# EAGLE design LEDboard (EAGLE 6.4)
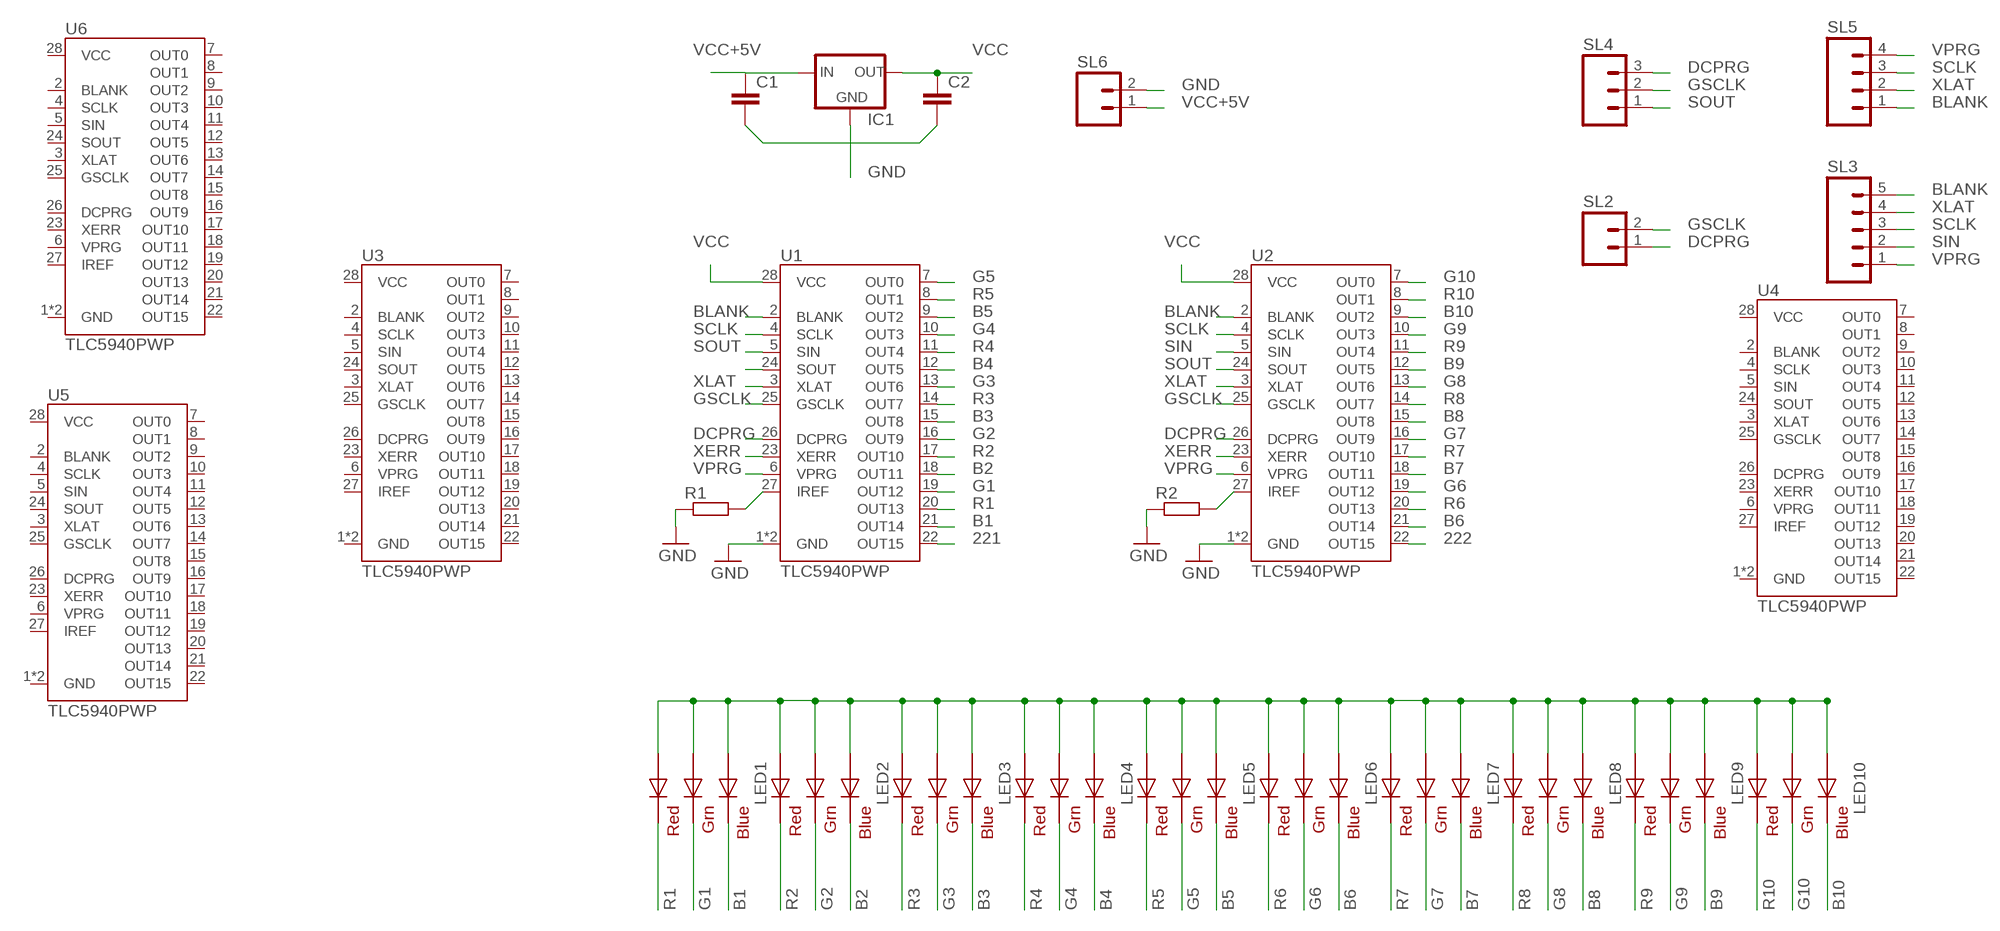
[diagram p0: schematic, sheet 1]

## Parts
C1  C-EU050-025X075  [C050-025X075]
C2  C-EU050-025X075  [C050-025X075]
IC1  78XXL  [78XXL]
LED1  RGBLED5050  [RGBLED5050]
LED2  RGBLED5050  [RGBLED5050]
LED3  RGBLED5050  [RGBLED5050]
LED4  RGBLED5050  [RGBLED5050]
LED5  RGBLED5050  [RGBLED5050]
LED6  RGBLED5050  [RGBLED5050]
LED7  RGBLED5050  [RGBLED5050]
LED8  RGBLED5050  [RGBLED5050]
LED9  RGBLED5050  [RGBLED5050]
LED10  RGBLED5050  [RGBLED5050]
R1  R-EU_M1406  [M1406]
R2  R-EU_M1406  [M1406]
SL2  M02  [02P]
SL3  M05  [05P]
SL4  M03  [03P]
SL5  M04  [04P]
SL6  M02  [02P]
U1  TLC5940PWP  [TSSOP28-GROUNDPAD]
U2  TLC5940PWP  [TSSOP28-GROUNDPAD]
U3  TLC5940PWP  [TSSOP28-GROUNDPAD]
U4  TLC5940PWP  [TSSOP28-GROUNDPAD]
U5  TLC5940PWP  [TSSOP28-GROUNDPAD]
U6  TLC5940PWP  [TSSOP28-GROUNDPAD]

## Nets
221: U1.22(OUT15)
222: U2.22(OUT15)
B1: LED1.4(BLUE_C) U1.21(OUT14)
B2: LED2.4(BLUE_C) U1.18(OUT11)
B3: LED3.4(BLUE_C) U1.15(OUT8)
B4: LED4.4(BLUE_C) U1.12(OUT5)
B5: LED5.4(BLUE_C) U1.9(OUT2)
B6: LED6.4(BLUE_C) U2.21(OUT14)
B7: LED7.4(BLUE_C) U2.18(OUT11)
B8: LED8.4(BLUE_C) U2.15(OUT8)
B9: LED9.4(BLUE_C) U2.12(OUT5)
B10: LED10.4(BLUE_C) U2.9(OUT2)
BLANK: SL3.5 SL5.1 U1.2(BLANK) U2.2(BLANK)
DCPRG: SL2.1 SL4.3 U1.26(DCPRG) U2.26(DCPRG)
G1: LED1.6(GREEN_C) U1.19(OUT12)
G2: LED2.6(GREEN_C) U1.16(OUT9)
G3: LED3.6(GREEN_C) U1.13(OUT6)
G4: LED4.6(GREEN_C) U1.10(OUT3)
G5: LED5.6(GREEN_C) U1.7(OUT0)
G6: LED6.6(GREEN_C) U2.19(OUT12)
G7: LED7.6(GREEN_C) U2.16(OUT9)
G8: LED8.6(GREEN_C) U2.13(OUT6)
G9: LED9.6(GREEN_C) U2.10(OUT3)
G10: LED10.6(GREEN_C) U2.7(OUT0)
GND: C1.2 C2.2 IC1.GND R1.1 R2.1 SL6.2 U1.1(GND) U1.29(GND) U2.1(GND) U2.29(GND)
GSCLK: SL2.2 SL4.2 U1.25(GSCLK) U2.25(GSCLK)
IREF: R1.2 R2.2 U1.27(IREF) U2.27(IREF)
R1: LED1.5(RED_C) U1.20(OUT13)
R2: LED2.5(RED_C) U1.17(OUT10)
R3: LED3.5(RED_C) U1.14(OUT7)
R4: LED4.5(RED_C) U1.11(OUT4)
R5: LED5.5(RED_C) U1.8(OUT1)
R6: LED6.5(RED_C) U2.20(OUT13)
R7: LED7.5(RED_C) U2.17(OUT10)
R8: LED8.5(RED_C) U2.14(OUT7)
R9: LED9.5(RED_C) U2.11(OUT4)
R10: LED10.5(RED_C) U2.8(OUT1)
SCLK: SL3.3 SL5.3 U1.4(SCLK) U2.4(SCLK)
SIN: SL3.2 U2.5(SIN)
SOUT: SL4.1 U1.5(SIN) U1.24(SOUT) U2.24(SOUT)
VCC: C2.1 IC1.OUT LED1.1(GREEN_A) LED1.2(RED_A) LED1.3(BLUE_A) LED2.1(GREEN_A) LED2.2(RED_A) LED2.3(BLUE_A) LED3.1(GREEN_A) LED3.2(RED_A) LED3.3(BLUE_A) LED4.1(GREEN_A) LED4.2(RED_A) LED4.3(BLUE_A) LED5.1(GREEN_A) LED5.2(RED_A) LED5.3(BLUE_A) LED6.1(GREEN_A) LED6.2(RED_A) LED6.3(BLUE_A) LED7.1(GREEN_A) LED7.2(RED_A) LED7.3(BLUE_A) LED8.1(GREEN_A) LED8.2(RED_A) LED8.3(BLUE_A) LED9.1(GREEN_A) LED9.2(RED_A) LED9.3(BLUE_A) LED10.1(GREEN_A) LED10.2(RED_A) LED10.3(BLUE_A) U1.28(VCC) U2.28(VCC)
VCC+5V: C1.1 IC1.IN SL6.1
VPRG: SL3.1 SL5.4 U1.6(VPRG) U2.6(VPRG)
XERR: U1.23(XERR) U2.23(XERR)
XLAT: SL3.4 SL5.2 U1.3(XLAT) U2.3(XLAT)
Unconnected: U3.1(GND) U3.2(BLANK) U3.3(XLAT) U3.4(SCLK) U3.5(SIN) U3.6(VPRG) U3.7(OUT0) U3.8(OUT1) U3.9(OUT2) U3.10(OUT3) U3.11(OUT4) U3.12(OUT5) U3.13(OUT6) U3.14(OUT7) U3.15(OUT8) U3.16(OUT9) U3.17(OUT10) U3.18(OUT11) U3.19(OUT12) U3.20(OUT13) U3.21(OUT14) U3.22(OUT15) U3.23(XERR) U3.24(SOUT) U3.25(GSCLK) U3.26(DCPRG) U3.27(IREF) U3.28(VCC) U3.29(GND) U4.1(GND) U4.2(BLANK) U4.3(XLAT) U4.4(SCLK) U4.5(SIN) U4.6(VPRG) U4.7(OUT0) U4.8(OUT1) U4.9(OUT2) U4.10(OUT3) U4.11(OUT4) U4.12(OUT5) U4.13(OUT6) U4.14(OUT7) U4.15(OUT8) U4.16(OUT9) U4.17(OUT10) U4.18(OUT11) U4.19(OUT12) U4.20(OUT13) U4.21(OUT14) U4.22(OUT15) U4.23(XERR) U4.24(SOUT) U4.25(GSCLK) U4.26(DCPRG) U4.27(IREF) U4.28(VCC) U4.29(GND) U5.1(GND) U5.2(BLANK) U5.3(XLAT) U5.4(SCLK) U5.5(SIN) U5.6(VPRG) U5.7(OUT0) U5.8(OUT1) U5.9(OUT2) U5.10(OUT3) U5.11(OUT4) U5.12(OUT5) U5.13(OUT6) U5.14(OUT7) U5.15(OUT8) U5.16(OUT9) U5.17(OUT10) U5.18(OUT11) U5.19(OUT12) U5.20(OUT13) U5.21(OUT14) U5.22(OUT15) U5.23(XERR) U5.24(SOUT) U5.25(GSCLK) U5.26(DCPRG) U5.27(IREF) U5.28(VCC) U5.29(GND) U6.1(GND) U6.2(BLANK) U6.3(XLAT) U6.4(SCLK) U6.5(SIN) U6.6(VPRG) U6.7(OUT0) U6.8(OUT1) U6.9(OUT2) U6.10(OUT3) U6.11(OUT4) U6.12(OUT5) U6.13(OUT6) U6.14(OUT7) U6.15(OUT8) U6.16(OUT9) U6.17(OUT10) U6.18(OUT11) U6.19(OUT12) U6.20(OUT13) U6.21(OUT14) U6.22(OUT15) U6.23(XERR) U6.24(SOUT) U6.25(GSCLK) U6.26(DCPRG) U6.27(IREF) U6.28(VCC) U6.29(GND)

## Library data of the parts
C1 C2 = rcl:C-EU: CAPACITOR, European symbol
IC1 = v-reg:78XXL: VOLTAGE REGULATOR
LED1-LED10 = adafruit:RGBLED: For 5050 RGB LEDs, the order of the LEDs may vary from one manufacturer to another!
R1 R2 = resistor:R-EU_: RESISTOR, European symbol
SL2 SL6 = con-amp-quick:M02: AMP QUICK CONNECTOR; OC_FARNELL: unknown; OC_NEWARK: unknown
SL3 = con-amp-quick:M05: AMP QUICK CONNECTOR; OC_FARNELL: unknown; OC_NEWARK: unknown
SL4 = con-amp-quick:M03: AMP QUICK CONNECTOR; OC_FARNELL: unknown; OC_NEWARK: unknown
SL5 = con-amp-quick:M04: AMP QUICK CONNECTOR; OC_FARNELL: unknown; OC_NEWARK: unknown
U1-U6 = SparkFun-DigitalIC:TLC5940: 16-channel LED Driver with Dot Correction and Grayscale PWM Control The TLC5940 is a 16-channel, constant-current sink LED driver. Each channel has an individually adjustable 4096-step grayscale PWM brightness control and a 64-step, constant-current sink (dot correction). The dot correction adjusts the brightness variations between LED channels and other LED drivers. The dot correction data is stored in an integrated EEPROM. Both grayscale control and dot correction are accessible via a serial interface. A single external resistor sets the maximum current value of all 16 channels. Packages: 28-pin HTSSOP 32-pin 5x5mm QFN 28-pin DIP

## Board
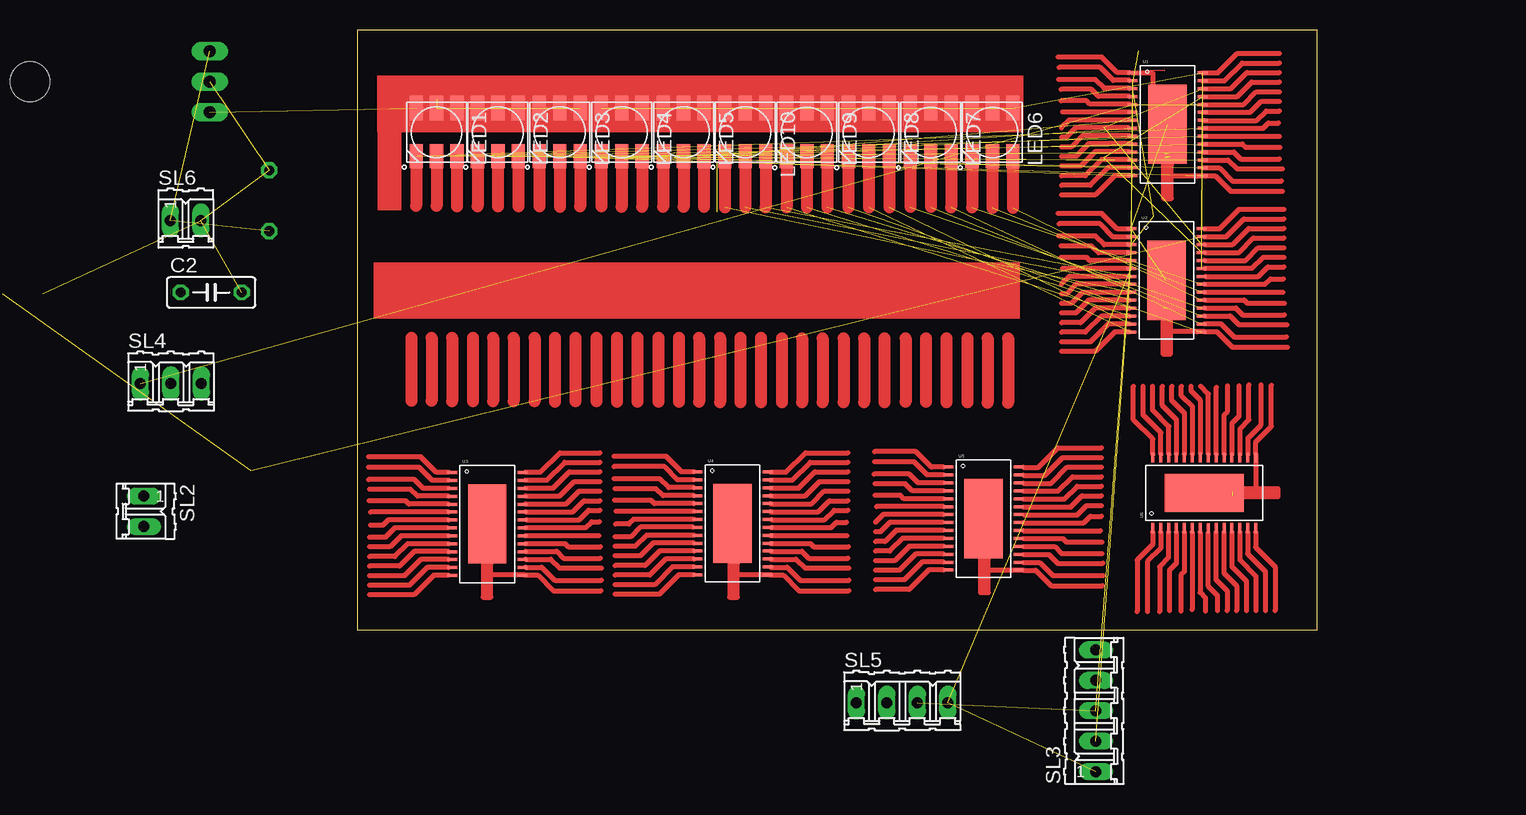
[diagram p1: board, top side]
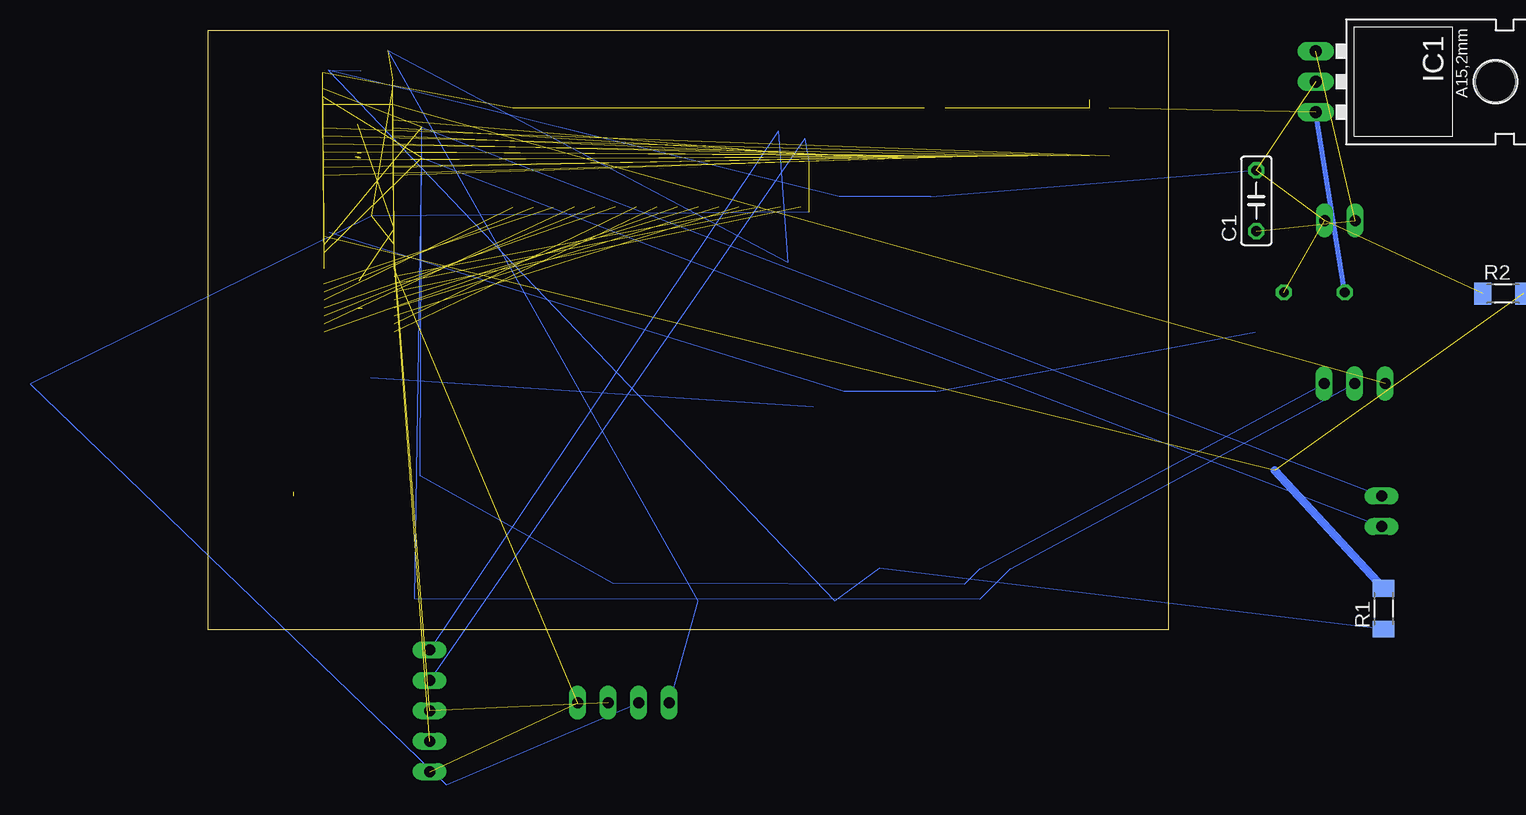
[diagram p2: board, bottom side, seen from below]

Size 80 x 50 mm. Coordinates in mm from the lower left corner, seen from the top.
Outline: 0,0 80,0 80,50 0,50 0,0
Copper layers (1*16): Top 0.035mm / dielectric 1.5mm / Bottom 0.035mm
Design rules "default *": minimum track width 0.002540625mm, minimum drill 24mil, track to track 8mil, track to pad 8mil, pad to pad 8mil, via to via 8mil, smd to smd 8mil, copper to edge 40mil, drill to drill 8mil, minimum pad ring 10mil, minimum via ring 8mil, stop-mask expansion 4mil, vias tented up to drill 0mil, thermal gap 10mil

### Footprints (pad centres in the part's own frame; a part is rotated, then mirrored left to right if it is on the bottom)
C050-025X075 = drill 0.813 octagon: 1 -2.54,0; 2 2.54,0
78XXL = drill 1.016 long: GND 0,-3.81; IN -2.54,-3.81; OUT 2.54,-3.81 | hole 3.302: 0,11.176
RGBLED5050 = smd 2 x 1.1: 1 -2,1.7; 2 -2,0; 3 -2,-1.7; 4 2,-1.7; 5 2,0; 6 2,1.7
M1406 = smd 1.4 x 1.8: 1 -1.7,0; 2 1.7,0
02P = drill 0.914 long: 1 -1.27,0; 2 1.27,0
05P = drill 0.914 long: 1 -5.08,0; 2 -2.54,0; 3 0,0; 4 2.54,0; 5 5.08,0
03P = drill 0.914 long: 1 -2.54,0; 2 0,0; 3 2.54,0
04P = drill 0.914 long: 1 -3.81,0; 2 -1.27,0; 3 1.27,0; 4 3.81,0
TSSOP28-GROUNDPAD = smd 0.8 x 0.25: 1 -2.921,4.298; 2 -2.921,3.637; 3 -2.921,2.977; 4 -2.921,2.317; 5 -2.921,1.656; 6 -2.921,0.996; 7 -2.921,0.335; 8 -2.927,-0.325; 9 -2.921,-0.985; 10 -2.921,-1.646; 11 -2.921,-2.306; 12 -2.921,-2.967; 13 -2.921,-3.627; 14 -2.921,-4.287; 15 2.921,-4.287; 16 2.921,-3.627; 17 2.921,-2.967; 18 2.921,-2.306; 19 2.921,-1.646; 20 2.921,-0.985; 21 2.927,-0.325; 22 2.921,0.335; 23 2.921,0.996; 24 2.921,1.656; 25 2.921,2.317; 26 2.921,2.977; 27 2.921,3.637; 28 2.921,4.298 | smd 3.2 x 6.6: 29 0,0.005

### Placement (x,y rotation side)
C1  -7.32,35.76 90 bottom  (outside the outline)
C2  -12.16,28.12 0 top  (outside the outline)
IC1  -16.08,45.68 270 bottom  (outside the outline)
LED1  6.62,41.49 270 top
LED2  11.74,41.49 270 top
LED3  16.89,41.48 270 top
LED4  22.05,41.48 270 top
LED5  27.21,41.48 270 top
LED6  52.95,41.46 270 top
LED7  47.81,41.46 270 top
LED8  42.65,41.46 270 top
LED9  37.49,41.46 270 top
LED10  32.35,41.48 270 top
R1  -17.93,1.75 90 bottom  (outside the outline)
R2  -27.88,28.02 0 bottom  (outside the outline)
SL2  -17.76,9.86 270 top  (outside the outline)
SL3  61.57,-6.77 90 top
SL4  -15.52,20.52 0 top  (outside the outline)
SL5  45.42,-6.1 0 top  (outside the outline)
SL6  -14.28,34.12 0 top  (outside the outline)
U1  67.55,42.13 0 top
U2  67.45,29.12 0 top
U3  10.85,8.8 0 top
U4  31.3,8.85 0 top
U5  52.2,9.25 0 top
U6  70.6,11.4 90 top

### Tracks (layer width: path | path; a pad name or v marks a point on that pad's centre or on a via)
B1  (1 unrouted)
  Top 0.4: U1.21 75.5,41.8 75.95,42.25 76.8,42.25
  Top 1: LED1.4 4.92,35.34
B2  (1 unrouted)
  Top 0.4: U1.18 73.08,39.82 73.65,39.25 76.87,39.25
  Top 1: LED2.4 10.04,35.3
B3  (1 unrouted)
  Top 0.4: U1.15 71.5,37.84 72.79,36.55 77.13,36.55
  Top 1: LED3.4 15.19,35.28
B4  (1 unrouted)
  Top 1: LED4.4 20.35,35.28
B5  (1 unrouted)
  Top 1: LED5.4 25.51,35.24
B6  (1 unrouted)
  Top 1: LED6.4 51.25,35.2
B7  (1 unrouted)
  Top 1: LED7.4 46.11,35.24
B8  (1 unrouted)
  Top 1: LED8.4 40.95,35.22
B9  (1 unrouted)
  Top 1: LED9.4 35.79,35.22
B10  (1 unrouted)
  Top 1: LED10.4 30.65,35.22
B11
  Top 0.4: 64.37,42.49 59.34,42.49 58.7,41.85
B12
  Top 0.4: 64.38,44.48 61.77,44.48 61.2,45.05 58.68,45.05
B13
  Top 0.4: 64.38,46.46 63.35,46.46 62.06,47.75 58.42,47.75
B14
  Top 0.4: 64.37,29.45 59.34,29.45 58.7,28.8
B15
  Top 0.4: 64.38,31.43 61.77,31.43 61.2,32 58.68,32
B16
  Top 0.4: 64.38,33.41 63.35,33.41 62.06,34.7 58.42,34.7
B17
  Top 0.4: 70.63,28.8 75.66,28.8 76.1,29.25 77.2,29.25
B18
  Top 0.4: 70.62,26.82 73.23,26.82 73.8,26.25 77.27,26.25
B19
  Top 0.4: 70.62,24.84 71.65,24.84 72.94,23.55 77.53,23.55
B20
  Top 0.4: 7.62,9.14 2.6,9.14 2.15,8.7 1.1,8.7
B21
  Top 0.4: 7.63,11.13 5.02,11.13 4.45,11.7 1.03,11.7
B22
  Top 0.4: 7.63,13.11 6.6,13.11 5.31,14.4 0.97,14.4
B23
  Top 0.4: 14.03,8.51 19.05,8.51 19.55,9 20.2,9
B24
  Top 0.4: 14.02,6.52 16.63,6.52 17.2,5.95 20.27,5.95
B25
  Top 0.4: 14.02,4.54 15.05,4.54 16.34,3.25 20.33,3.25
B26
  Top 0.4: 28.07,9.2 23.05,9.2 22.65,8.8 21.55,8.8
B27
  Top 0.4: 28.08,11.18 25.47,11.18 24.9,11.75 21.48,11.75
B28
  Top 0.4: 28.08,13.16 27.05,13.16 25.76,14.45 21.42,14.45
B29
  Top 0.4: 34.48,8.51 39.51,8.51 39.95,8.95 40.8,8.95
B30
  Top 0.4: 34.47,6.52 37.08,6.52 37.65,5.95 40.92,5.95
B31
  Top 0.4: 34.47,4.54 35.5,4.54 36.79,3.25 40.98,3.25
B32
  Top 0.4: 70.25,8.12 70.25,3.1 70.7,2.65 70.7,1.55
B33
  Top 0.4: 68.27,8.13 68.27,5.52 67.7,4.95 67.7,1.58
B34
  Top 0.4: 66.29,8.13 66.29,7.1 65,5.81 65,1.52
B35
  Top 0.4: 70.94,14.63 70.94,19.66 70.3,20.3
B36
  Top 0.4: 72.93,14.62 72.93,17.23 73.5,17.8 73.5,20.32
B37
  Top 0.4: 74.91,14.62 74.91,15.65 76.2,16.94 76.2,20.38
B38
  Top 0.4: 48.87,9.6 43.84,9.6 43.2,8.95
B39
  Top 0.4: 48.88,11.58 46.27,11.58 45.7,12.15 43.18,12.15
B40
  Top 0.4: 48.88,13.56 47.85,13.56 46.56,14.85 43.12,14.85
B41
  Top 0.4: 55.53,8.9 60.55,8.9 61.1,9.45 62.05,9.45
B42
  Top 0.4: 55.52,6.92 58.13,6.92 58.7,6.35 62.07,6.35
B43
  Top 0.4: 55.52,4.94 56.55,4.94 57.84,3.65 62.13,3.65
B44
  Top 1: 4.52,24.34 4.52,19.09
B45
  Top 1: 9.64,24.34 9.64,19.05
B46
  Top 1: 14.79,24.33 14.79,19.03
B47
  Top 1: 19.95,24.33 19.95,19.03
B48
  Top 1: 25.11,24.33 25.11,18.99
B49
  Top 1: 50.85,24.31 50.85,18.95
B50
  Top 1: 45.71,24.31 45.71,18.99
B51
  Top 1: 40.55,24.31 40.55,18.97
B52
  Top 1: 35.39,24.31 35.39,18.97
B53
  Top 1: 30.25,24.33 30.25,18.97
BLANK  (2 unrouted)
  Bottom 0.003: SL5.1 39.23,2.4 65.08,48.28 31.72,30.62 32.53,41.57 SL3.5
DCPRG  (2 unrouted)
  Top 0.4: U1.26 72.81,45.11 74.15,46.45 76.85,46.45
  Bottom 0.003: SL2.1 62.23,41.91 62.37,12.8 46.32,3.84 17.01,3.79 15.74,5.06 SL4.3
DCPRG1
  Top 0.4: 64.38,39.19 62.04,39.19 60.7,37.85 58.7,37.85
DCPRG2
  Top 0.4: 64.38,26.14 62.04,26.14 60.7,24.8 58.7,24.8
DCPRG3
  Top 0.4: 70.62,32.11 72.96,32.11 74.3,33.45 77.25,33.45
DCPRG4
  Top 0.4: 7.63,5.84 5.29,5.84 3.95,4.5 1.05,4.5
DCPRG5
  Top 0.4: 14.02,11.81 16.36,11.81 17.7,13.15 20.25,13.15
DCPRG6
  Top 0.4: 28.08,5.89 25.74,5.89 24.4,4.55 21.5,4.55
DCPRG7
  Top 0.4: 34.47,11.81 36.81,11.81 38.15,13.15 40.9,13.15
DCPRG8
  Top 0.4: 73.56,8.13 73.56,5.79 74.9,4.45 74.9,1.6
DCPRG9
  Top 0.4: 67.64,14.62 67.64,16.96 66.3,18.3 66.3,20.3
DCPRG10
  Top 0.4: 48.88,6.29 46.54,6.29 45.2,4.95 43.2,4.95
DCPRG11
  Top 0.4: 55.52,12.21 57.86,12.21 59.2,13.55 62.05,13.55
G1  (1 unrouted)
  Top 0.4: U1.19 73.78,40.48 74.05,40.21 76.89,40.21
  Top 1: LED1.6 8.32,35.3
G2  (1 unrouted)
  Top 0.4: U1.16 71.84,38.5 72.93,37.41 77.05,37.41
  Top 1: LED2.6 13.44,35.3
G3  (1 unrouted)
  Top 1: LED3.6 18.59,35.28
G4  (1 unrouted)
  Top 1: LED4.6 23.75,35.26
G5  (1 unrouted)
  Top 1: LED5.6 28.91,35.26
G6  (1 unrouted)
  Top 1: LED6.6 54.65,35.18
G7  (1 unrouted)
  Top 1: LED7.6 49.51,35.22
G8  (1 unrouted)
  Top 1: LED8.6 44.35,35.22
G9  (1 unrouted)
  Top 1: LED9.6 39.19,35.22
G10  (1 unrouted)
  Top 1: LED10.6 34.05,35.22
G11
  Top 0.4: 64.38,43.82 61.07,43.82 60.8,44.09 58.66,44.09
G12
  Top 0.4: 64.38,45.8 63.01,45.8 61.92,46.89 58.5,46.89
G13
  Top 0.4: 64.38,30.77 61.07,30.77 60.8,31.04 58.66,31.04
G14
  Top 0.4: 64.38,32.75 63.01,32.75 61.92,33.84 58.5,33.84
G15
  Top 0.4: 70.62,27.48 73.93,27.48 74.2,27.21 77.29,27.21
G16
  Top 0.4: 70.62,25.5 71.99,25.5 73.08,24.41 77.45,24.41
G17
  Top 0.4: 7.63,10.47 4.32,10.47 4.05,10.74 1.01,10.74
G18
  Top 0.4: 7.63,12.45 6.26,12.45 5.17,13.54 0.95,13.54
G19
  Top 0.4: 14.02,7.18 17.33,7.18 17.6,6.91 20.29,6.91
G20
  Top 0.4: 14.02,5.2 15.39,5.2 16.48,4.11 20.35,4.11
G21
  Top 0.4: 28.08,10.52 24.77,10.52 24.5,10.79 21.46,10.79
G22
  Top 0.4: 28.08,12.5 26.71,12.5 25.62,13.59 21.4,13.59
G23
  Top 0.4: 34.47,7.18 37.78,7.18 38.05,6.91 40.94,6.91
G24
  Top 0.4: 34.47,5.2 35.84,5.2 36.93,4.11 41,4.11
G25
  Top 0.4: 68.93,8.13 68.93,4.82 68.66,4.55 68.66,1.56
G26
  Top 0.4: 66.95,8.13 66.95,6.76 65.86,5.67 65.86,1.5
G27
  Top 0.4: 72.27,14.62 72.27,17.93 72.54,18.2 72.54,20.34
G28
  Top 0.4: 74.25,14.62 74.25,15.99 75.34,17.08 75.34,20.4
G29
  Top 0.4: 48.88,10.92 45.57,10.92 45.3,11.19 43.16,11.19
G30
  Top 0.4: 48.88,12.9 47.51,12.9 46.42,13.99 43.1,13.99
G31
  Top 0.4: 55.52,7.58 58.83,7.58 59.1,7.31 62.09,7.31
G32
  Top 0.4: 55.52,5.6 56.89,5.6 57.98,4.51 62.15,4.51
G33
  Top 1: 7.92,24.34 7.92,19.05
G34
  Top 1: 13.04,24.34 13.04,19.05
G35
  Top 1: 18.19,24.33 18.19,19.03
G36
  Top 1: 23.35,24.33 23.35,19.01
G37
  Top 1: 28.51,24.33 28.51,19.01
G38
  Top 1: 54.25,24.31 54.25,18.93
G39
  Top 1: 49.11,24.31 49.11,18.97
G40
  Top 1: 43.95,24.31 43.95,18.97
G41
  Top 1: 38.79,24.31 38.79,18.97
G42
  Top 1: 33.65,24.33 33.65,18.97
GND  (7 unrouted)
  Top 0.003: 67.31,46.6 66.04,46.6 66.04,46.43
  Top 0.406: U1.29 66.31,44.97 66.31,46.43 66.04,46.43 U1.1
  Bottom 0.003: 70,46.65 27.45,36.1 19.83,36.1 C1.2 | 70,46.65 27.8,2.4 24.06,5.16 R1.1 | 70,46.65 67.31,46.6
GND1
  Bottom 0.003: 69.95,33.1 27.05,19.85 19.43,19.85 -7.22,24.8
GSCLK  (2 unrouted)
  Top 0.4: U1.25 73.35,44.45 74.55,45.65 76.85,45.65
  Bottom 0.003: SL2.2 62.23,39.37 62.83,2.57 15.74,2.52 13.2,5.06 SL4.2
GSCLK1
  Top 0.4: 64.38,39.85 61.5,39.85 60.3,38.65 58.7,38.65
GSCLK2
  Top 0.4: 64.38,26.8 61.5,26.8 60.3,25.6 58.7,25.6
GSCLK3
  Top 0.4: 70.62,31.45 73.5,31.45 74.7,32.65 77.25,32.65
GSCLK4
  Top 0.4: 7.63,6.5 4.75,6.5 3.55,5.3 1.05,5.3
GSCLK5
  Top 0.4: 14.02,11.15 16.9,11.15 18.1,12.35 20.25,12.35
GSCLK6
  Top 0.4: 28.08,6.55 25.2,6.55 24,5.35 21.5,5.35
GSCLK7
  Top 0.4: 34.47,11.15 37.35,11.15 38.55,12.35 40.9,12.35
GSCLK8
  Top 0.4: 72.9,8.13 72.9,5.25 74.1,4.05 74.1,1.6
GSCLK9
  Top 0.4: 68.3,14.62 68.3,17.5 67.1,18.7 67.1,20.3
GSCLK10
  Top 0.4: 48.88,6.95 46,6.95 44.8,5.75 43.2,5.75
GSCLK11
  Top 0.4: 55.52,11.55 58.4,11.55 59.6,12.75 62.05,12.75
IREF  (3 unrouted)
  Top 0.4: U1.27 72.27,45.77 73.75,47.25 76.85,47.25
  Bottom 0.7: -8.86,13.27 R1.2
IREF1
  Top 0.4: 64.38,38.53 62.58,38.53 61.1,37.05 58.7,37.05
IREF2
  Top 0.4: 64.38,25.48 62.58,25.48 61.1,24 58.7,24
IREF3
  Top 0.4: 70.62,32.77 72.42,32.77 73.9,34.25 77.25,34.25
IREF4
  Top 0.4: 7.63,5.18 5.83,5.18 4.35,3.7 1.05,3.7
IREF5
  Top 0.4: 14.02,12.47 15.82,12.47 17.3,13.95 20.25,13.95
IREF6
  Top 0.4: 28.08,5.23 26.28,5.23 24.8,3.75 21.5,3.75
IREF7
  Top 0.4: 34.47,12.47 36.27,12.47 37.75,13.95 40.9,13.95
IREF8
  Top 0.4: 74.22,8.13 74.22,6.33 75.7,4.85 75.7,1.6
IREF9
  Top 0.4: 66.98,14.62 66.98,16.42 65.5,17.9 65.5,20.3
IREF10
  Top 0.4: 48.88,5.63 47.08,5.63 45.6,4.15 43.2,4.15
IREF11
  Top 0.4: 55.52,12.87 57.32,12.87 58.8,14.35 62.05,14.35
N$2
  Top 0.4: 70.55,42.45 74.95,42.45 75.75,43.25 76.85,43.25
N$4
  Top 0.4: 64.3,41.85 59.9,41.85 59.1,41.05 58.7,41.05
N$5
  Top 0.4: 64.3,28.8 59.9,28.8 59.1,28 58.7,28
N$6
  Top 0.4: 70.7,29.45 75.1,29.45 75.9,30.25 77.25,30.25
N$7
  Top 0.4: 7.55,8.5 3.15,8.5 2.35,7.7 1.05,7.7
N$8
  Top 0.4: 14.1,9.15 18.5,9.15 19.3,9.95 20.25,9.95
N$9
  Top 0.4: 28,8.55 23.6,8.55 22.8,7.75 21.5,7.75
N$10
  Top 0.4: 34.55,9.15 38.95,9.15 39.75,9.95 40.9,9.95
N$11
  Top 0.4: 70.9,8.05 70.9,3.65 71.7,2.85 71.7,1.6
N$12
  Top 0.4: 70.3,14.7 70.3,19.1 69.5,19.9 69.5,20.3
N$13
  Top 0.4: 48.8,8.95 44.4,8.95 43.6,8.15 43.2,8.15
N$14
  Top 0.4: 55.6,9.55 60,9.55 60.8,10.35 62.05,10.35
N$15
  Top 0.4: 14,4.55 10.75,4.55 10.75,6.2 11.05,6.2 11.05,4.8
N$16
  Top 0.4: 34.55,4.55 31.15,4.55 31.15,6.1 31.45,6.1 31.45,4.65
N$17
  Top 0.4: 54.8,4.95 52,4.95 52,6.9 52.35,6.9 52.35,5.25
N$18
  Top 0.4: 74.85,11.15 73.2,11.15 73.2,11.5 74.7,11.5
N$19
  Top 0.4: 10.5,5.75 10.5,2.7 11.15,2.7 11.15,5.5 11.1,5.5 11.1,2.95 10.75,2.95 10.75,4.5 10.85,4.5
N$20
  Top 0.4: 34.55,4.55 31.3,4.55 31.3,6.2 31.6,6.2 31.6,4.8
N$21
  Top 0.4: 31.05,5.75 31.05,2.7 31.7,2.7 31.7,5.5 31.65,5.5 31.65,2.95 31.3,2.95 31.3,4.5 31.4,4.5
N$23
  Top 0.4: 55.45,4.95 52.05,4.95 52.05,6.5 52.35,6.5 52.35,5.05
N$24
  Top 0.4: 55.45,4.95 52.2,4.95 52.2,6.6 52.5,6.6 52.5,5.2
N$25
  Top 0.4: 51.95,6.15 51.95,3.1 52.6,3.1 52.6,5.9 52.55,5.9 52.55,3.35 52.2,3.35 52.2,4.9 52.3,4.9
N$26  (1 unrouted)
  Top 0.4: 74.9,13.95 74.9,11.15 72.95,11.15 | 72.95,11.5 74.6,11.5
N$27
  Top 0.4: 74.9,14.6 74.9,11.2 73.35,11.2 73.35,11.5 74.8,11.5
N$28
  Top 0.4: 74.9,14.6 74.9,11.35 73.25,11.35 73.25,11.65 74.65,11.65
N$29
  Top 0.4: 73.7,11.1 76.75,11.1 76.75,11.75 73.95,11.75 73.95,11.7 76.5,11.7 76.5,11.35 74.95,11.35 74.95,11.45
N$30  (1 unrouted)
  Top 0.4: 70,24.85 67.2,24.85 67.2,26.8 | 67.55,26.8 67.55,25.15
N$31
  Top 0.4: 70.65,24.85 67.25,24.85 67.25,26.4 67.55,26.4 67.55,24.95
N$32
  Top 0.4: 70.65,24.85 67.4,24.85 67.4,26.5 67.7,26.5 67.7,25.1
N$33
  Top 0.4: 67.15,26.05 67.15,23 67.8,23 67.8,25.8 67.75,25.8 67.75,23.25 67.4,23.25 67.4,24.8 67.5,24.8
N$34  (1 unrouted)
  Top 0.4: 70.05,37.8 67.25,37.8 67.25,39.75 | 67.6,39.75 67.6,38.1
N$35  (1 unrouted)
  Top 0.4: 70.7,37.8 67.3,37.8 67.3,39.35 | 67.6,39.35 67.6,37.9
N$36  (1 unrouted)
  Top 0.4: 70.7,37.8 67.45,37.8 67.45,39.45 | 67.75,39.45 67.75,38.05
N$37
  Top 0.4: 67.2,39 67.2,35.95 67.85,35.95 67.85,38.75 67.8,38.75 67.8,36.2 67.45,36.2 67.45,37.75 67.55,37.75
R1  (1 unrouted)
  Top 0.4: U1.20 76.86,41.15
  Top 1: LED1.5 6.62,35.32
R2  (1 unrouted)
  Top 0.4: U1.17 72.6,39.16 73.33,38.43 77.11,38.43
  Top 1: LED2.5 11.74,35.3
R3  (1 unrouted)
  Top 1: LED3.5 16.89,35.26
R4  (1 unrouted)
  Top 1: LED4.5 22.05,35.26
R5  (1 unrouted)
  Top 1: LED5.5 27.21,35.24
R6  (1 unrouted)
  Top 1: LED6.5 52.95,35.18
R7  (1 unrouted)
  Top 1: LED7.5 47.81,35.24
R8  (1 unrouted)
  Top 1: LED8.5 42.65,35.22
R9  (1 unrouted)
  Top 1: LED9.5 37.49,35.22
R10  (1 unrouted)
  Top 1: LED10.5 32.35,35.22
R11
  Top 0.4: 64.38,43.16 58.78,43.16
R12
  Top 0.4: 64.38,45.14 62.25,45.14 61.52,45.87 58.44,45.87
R13
  Top 0.4: 64.38,30.11 58.78,30.11
R14
  Top 0.4: 64.38,32.09 62.25,32.09 61.52,32.82 58.44,32.82
R15
  Top 0.4: 70.62,28.14 77.17,28.14
R16
  Top 0.4: 70.62,26.16 72.75,26.16 73.48,25.43 77.51,25.43
R17
  Top 0.4: 7.63,9.8 1.14,9.8
R18
  Top 0.4: 7.63,11.79 5.5,11.79 4.77,12.52 0.94,12.52
R19
  Top 0.4: 14.02,7.84 20.16,7.84
R20
  Top 0.4: 14.02,5.86 16.15,5.86 16.88,5.13 20.36,5.13
R21
  Top 0.4: 28.08,9.86 21.59,9.86
R22
  Top 0.4: 28.08,11.84 25.95,11.84 25.22,12.57 21.39,12.57
R23
  Top 0.4: 34.47,7.84 40.81,7.84
R24
  Top 0.4: 34.47,5.86 36.6,5.86 37.33,5.13 41.01,5.13
R25
  Top 0.4: 69.59,8.13 69.59,1.69
R26
  Top 0.4: 67.61,8.13 67.61,6 66.88,5.27 66.88,1.49
R27
  Top 0.4: 71.61,14.62 71.61,20.21
R28
  Top 0.4: 73.59,14.62 73.59,16.75 74.32,17.48 74.32,20.41
R29
  Top 0.4: 48.88,10.26 43.28,10.26
R30
  Top 0.4: 48.88,12.24 46.75,12.24 46.02,12.97 43.09,12.97
R31
  Top 0.4: 55.52,8.24 61.97,8.24
R32
  Top 0.4: 55.52,6.26 57.65,6.26 58.38,5.53 62.16,5.53
R33
  Top 1: 6.22,24.34 6.22,19.07
R34
  Top 1: 11.34,24.34 11.34,19.05
R35
  Top 1: 16.49,24.33 16.49,19.01
R36
  Top 1: 21.65,24.33 21.65,19.01
R37
  Top 1: 26.81,24.33 26.81,18.99
R38
  Top 1: 52.55,24.31 52.55,18.93
R39
  Top 1: 47.41,24.31 47.41,18.99
R40
  Top 1: 42.25,24.31 42.25,18.97
R41
  Top 1: 37.09,24.31 37.09,18.97
R42
  Top 1: 31.95,24.33 31.95,18.97
SCLK  (3 unrouted)
SIN  (1 unrouted)
SOUT  (3 unrouted)
  Top 0.4: U1.24 73.89,43.79 74.95,44.85 76.85,44.85
SOUT1
  Top 0.4: 64.38,40.51 60.96,40.51 59.9,39.45 58.7,39.45
SOUT2
  Top 0.4: 64.38,27.46 60.96,27.46 59.9,26.4 58.7,26.4
SOUT3
  Top 0.4: 70.62,30.79 74.04,30.79 75.1,31.85 77.25,31.85
SOUT4
  Top 0.4: 7.63,7.16 4.21,7.16 3.15,6.1 1.05,6.1
SOUT5
  Top 0.4: 14.02,10.49 17.44,10.49 18.5,11.55 20.25,11.55
SOUT6
  Top 0.4: 28.08,7.21 24.66,7.21 23.6,6.15 21.5,6.15
SOUT7
  Top 0.4: 34.47,10.49 37.89,10.49 38.95,11.55 40.9,11.55
SOUT8
  Top 0.4: 72.24,8.13 72.24,4.71 73.3,3.65 73.3,1.6
SOUT9
  Top 0.4: 68.96,14.62 68.96,18.04 67.9,19.1 67.9,20.3
SOUT10
  Top 0.4: 48.88,7.61 45.46,7.61 44.4,6.55 43.2,6.55
SOUT11
  Top 0.4: 55.52,10.89 58.94,10.89 60,11.95 62.05,11.95
VCC  (31 unrouted)
  Top 0.003: 6.62,44.19 5.35,44.19 LED1.3
  Top 0.4: U1.28 71.73,46.43 73.35,48.05 76.85,48.05
  Top 0.406: LED2.1 | LED3.1 LED4.3 | 54.61,43.46 LED6.1 | LED9.3 35.79,43.48
  Bottom 0.406: C2.1 IC1.OUT
VCC1
  Top 0.4: 64.38,37.87 63.12,37.87 61.5,36.25 58.7,36.25
VCC2
  Top 0.4: 64.38,24.82 63.12,24.82 61.5,23.2 58.7,23.2
VCC3
  Top 0.4: 70.62,33.43 71.88,33.43 73.5,35.05 77.25,35.05
VCC4
  Top 0.4: 7.63,4.52 6.37,4.52 4.75,2.9 1.05,2.9
VCC5
  Top 0.4: 14.02,13.13 15.28,13.13 16.9,14.75 20.25,14.75
VCC6
  Top 0.4: 28.08,4.57 26.82,4.57 25.2,2.95 21.5,2.95
VCC7
  Top 0.4: 34.47,13.13 35.73,13.13 37.35,14.75 40.9,14.75
VCC8
  Top 0.4: 74.88,8.13 74.88,6.87 76.5,5.25 76.5,1.6
VCC9
  Top 0.4: 66.32,14.62 66.32,15.88 64.7,17.5 64.7,20.3
VCC10
  Top 0.4: 48.88,4.97 47.62,4.97 46,3.35 43.2,3.35
VCC11
  Top 0.4: 55.52,13.53 56.78,13.53 58.4,15.15 62.05,15.15
VCC+5V  (2 unrouted)
VPRG  (3 unrouted)
XERR  (1 unrouted)
  Top 0.4: U1.23 74.43,43.13 75.35,44.05 76.85,44.05
XERR1
  Top 0.4: 64.38,41.17 60.42,41.17 59.5,40.25 58.7,40.25
XERR2
  Top 0.4: 64.38,28.12 60.42,28.12 59.5,27.2 58.7,27.2
XERR3
  Top 0.4: 70.62,30.13 74.58,30.13 75.5,31.05 77.25,31.05
XERR4
  Top 0.4: 7.63,7.82 3.67,7.82 2.75,6.9 1.05,6.9
XERR5
  Top 0.4: 14.02,9.83 17.98,9.83 18.9,10.75 20.25,10.75
XERR6
  Top 0.4: 28.08,7.87 24.12,7.87 23.2,6.95 21.5,6.95
XERR7
  Top 0.4: 34.47,9.83 38.43,9.83 39.35,10.75 40.9,10.75
XERR8
  Top 0.4: 71.58,8.13 71.58,4.17 72.5,3.25 72.5,1.6
XERR9
  Top 0.4: 69.62,14.62 69.62,18.58 68.7,19.5 68.7,20.3
XERR10
  Top 0.4: 48.88,8.27 44.92,8.27 44,7.35 43.2,7.35
XERR11
  Top 0.4: 55.52,10.23 59.48,10.23 60.4,11.15 62.05,11.15
XLAT  (3 unrouted)
  Bottom 0.003: 29.99,34.83 66.38,34.5 94.87,20.5 60.17,-12.95 SL5.2 | 29.99,39.03 30.33,40.93 SL3.4
XLAT1
  Bottom 0.003: 29.59,18.58 66.48,21
(copper drawn outside any net)
  shapes: Top area x3